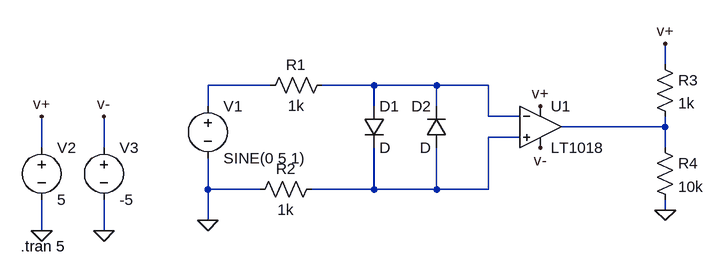
[diagram p0: schematic Detector_de_cruce_por_cero.asc]
Detector_de_cruce_por_cero.asc, the LTspice schematic file:
Version 4
SHEET 1 880 680
WIRE 304 -32 304 -64
WIRE -304 0 -400 0
WIRE -144 0 -224 0
WIRE -48 0 -144 0
WIRE 32 0 -48 0
WIRE -400 32 -400 0
WIRE -144 32 -144 0
WIRE -48 32 -48 0
WIRE 32 48 32 0
WIRE 80 48 32 48
WIRE 304 64 304 48
WIRE 304 64 144 64
WIRE 80 80 32 80
WIRE -656 96 -656 48
WIRE -560 96 -560 48
WIRE 304 96 304 64
WIRE -400 160 -400 112
WIRE -320 160 -400 160
WIRE -144 160 -144 96
WIRE -144 160 -240 160
WIRE -48 160 -48 96
WIRE -48 160 -144 160
WIRE 32 160 32 80
WIRE 32 160 -48 160
WIRE 304 192 304 176
WIRE -400 208 -400 160
WIRE -656 224 -656 176
WIRE -560 224 -560 176
FLAG -400 208 0
FLAG 304 192 0
FLAG -560 224 0
FLAG -656 224 0
FLAG -656 48 v+
FLAG -560 48 v-
FLAG 112 96 v-
FLAG 112 32 v+
FLAG 304 -64 v+
SYMBOL Comparators\\LT1018 112 64 R0
SYMATTR InstName U1
SYMBOL diode -160 32 R0
SYMATTR InstName D1
SYMBOL diode -32 96 R180
WINDOW 0 24 64 Left 2
WINDOW 3 24 0 Left 2
SYMATTR InstName D2
SYMBOL voltage -400 16 R0
WINDOW 123 0 0 Left 0
WINDOW 39 0 0 Left 0
SYMATTR InstName V1
SYMATTR Value SINE(0 5 1)
SYMBOL res -208 -16 R90
WINDOW 0 0 56 VBottom 2
WINDOW 3 32 56 VTop 2
SYMATTR InstName R1
SYMATTR Value 1k
SYMBOL res -224 144 R90
WINDOW 0 0 56 VBottom 2
WINDOW 3 32 56 VTop 2
SYMATTR InstName R2
SYMATTR Value 1k
SYMBOL voltage -656 80 R0
WINDOW 123 0 0 Left 0
WINDOW 39 0 0 Left 0
SYMATTR InstName V2
SYMATTR Value 5
SYMBOL voltage -560 80 R0
WINDOW 123 0 0 Left 0
WINDOW 39 0 0 Left 0
SYMATTR InstName V3
SYMATTR Value -5
SYMBOL res 288 80 R0
SYMATTR InstName R4
SYMATTR Value 10k
SYMBOL res 288 -48 R0
SYMATTR InstName R3
SYMATTR Value 1k
TEXT -688 248 Left 2 !.tran 5

The netlist it stands for:
* Detector_de_cruce_por_cero.asc
XU1 N004 N002 v+ v- N003 LT1018  ; pins In+ In- V+ V- OUT
D1 N002 N004 D
D2 N004 N002 D
V1 N001 0 SINE(0 5 1)
R1 N002 N001 1k
R2 N004 0 1k
V2 v+ 0 5
V3 v- 0 -5
R4 N003 0 10k
R3 v+ N003 1k
.model D D
.lib standard.dio
.tran 5
.lib LTC1.lib
.backanno
.end